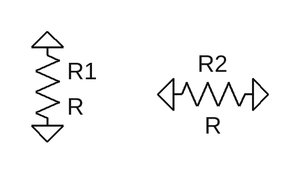
[diagram p0: schematic ground_up.asc]
ground_up.asc, the LTspice schematic file:
Version 4
SHEET 1 880 680
FLAG 112 64 0
FLAG 112 144 0
FLAG 320 112 0
FLAG 240 112 0
SYMBOL res 96 48 R0
SYMATTR InstName R1
SYMBOL res 336 96 R90
WINDOW 0 0 56 VBottom 2
WINDOW 3 32 56 VTop 2
SYMATTR InstName R2

The netlist it stands for:
* ground_up.asc
R1 0 0 R
R2 0 0 R
.backanno
.end